# Altium schematic sheet Sensors.SchDoc: Sensors
size 279 x 203 mm; DrawnBy: FitC Engineers; Revision: 1; SheetNumber: 4; SheetTotal: 5
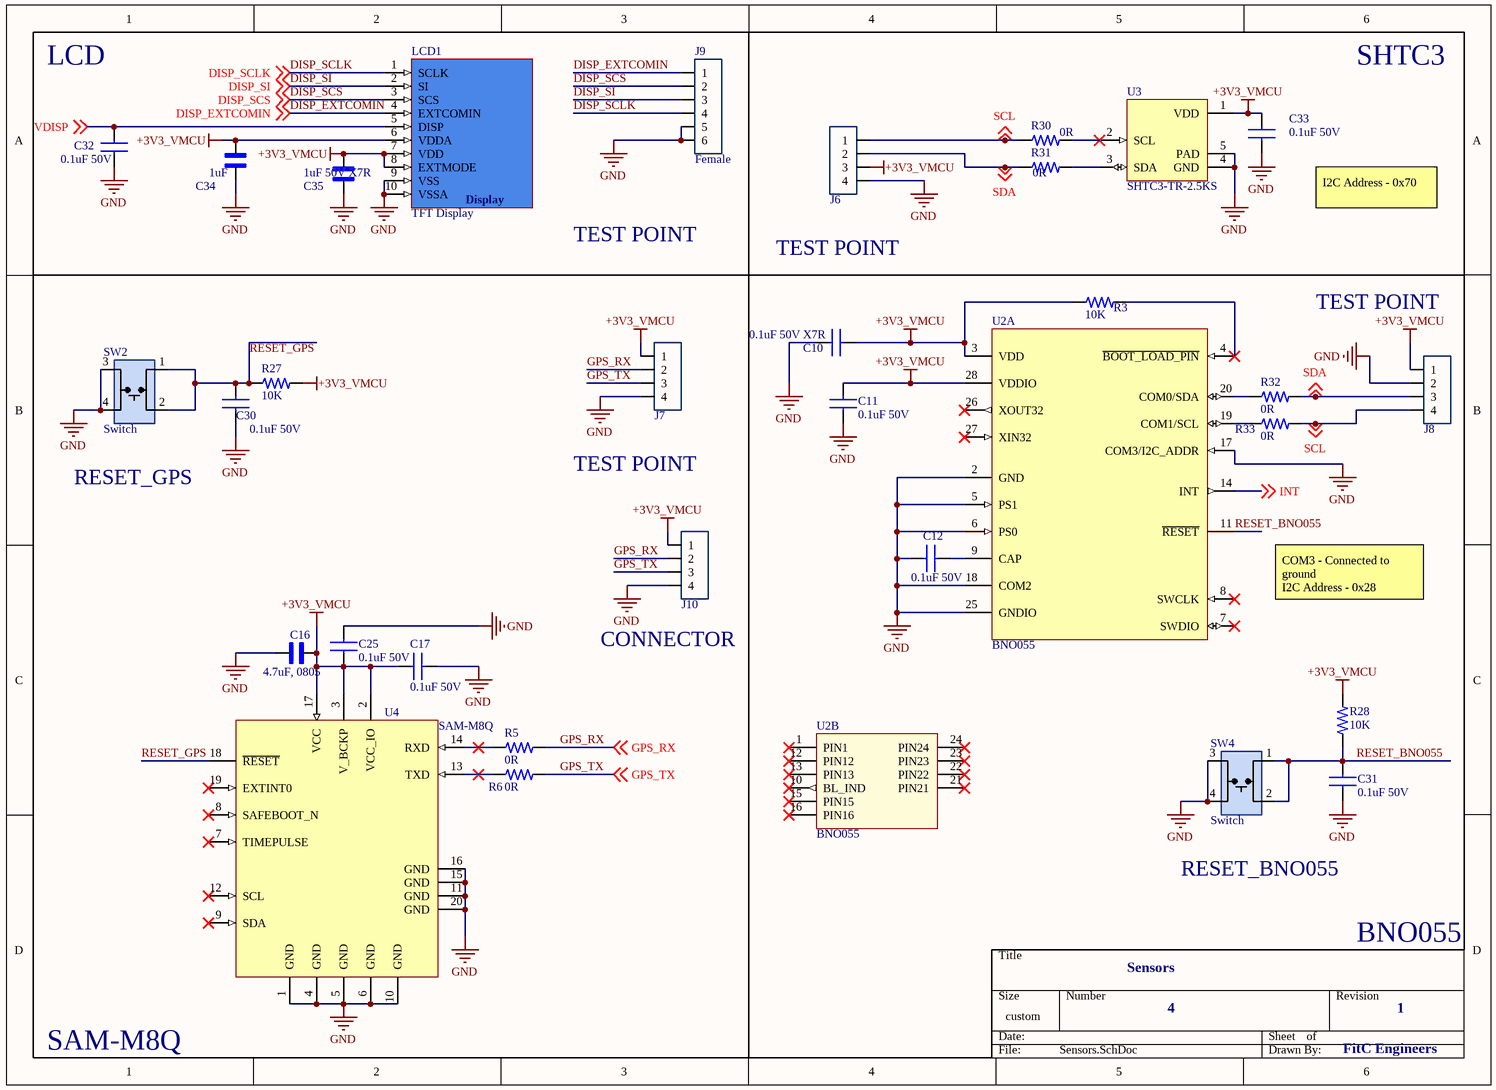
[diagram p0: Sensors.SchDoc]

## Parts
C10  0.1uF 50V X7R  [CAP_0603_1MM]
C11  0.1uF 50V  [CAP_0603_1MM]
C12  0.1uF 50V  [CAP_0603_1MM]
C16  4.7uF, 0805  [CAP_0805_2012X14]
C17  0.1uF 50V  [CAP_0603_1MM]
C25  0.1uF 50V  [CAP_0603_1MM]
C30  0.1uF 50V  [CAP_0603_1MM]
C31  0.1uF 50V  [CAP_0603_1MM]
C32  0.1uF 50V  [CAP_0603_1MM]
C33  0.1uF 50V  [CAP_0603_1MM]
C34  1uF  [CAP_0603_1MM]
C35  1uF 50V X7R  [CAP_0603_1MM]
J6  J_4_PIN_HEADER  [4_PIN_100MIL]  (value not drawn)
J7  J_4_PIN_HEADER  [4_PIN_100MIL]  (value not drawn)
J8  J_4_PIN_HEADER  [4_PIN_100MIL]  (value not drawn)
J9  value Female  [6_PIN_100MIL]  (hidden comment: PPTC061LFBN-RC)
J10  J_4_PIN_HEADER  [4_PIN_100MIL]  (value not drawn)
LCD1  TFT Display  [10Pin_LCD_Connector]
R3  10K  [RES_0603_1608X06]
R5  0R  [RES_0603_1608X06]
R6  0R  [RES_0603_1608X06]
R27  10K  [RES_0603_1608X06]
R28  10K  [RES_0603_1608X06]
R30  0R  [RES_0603_1608X06]
R31  0R  [RES_0603_1608X06]
R32  0R  [RES_0603_1608X06]
R33  0R  [RES_0603_1608X06]
SW2  Switch  [SWITCH]
SW4  Switch  [SWITCH]
U2  BNO055  [BNO055_LGA]  (parts A,B of 2)
U3  SHTC3-TR-2.5KS  [SHTC3_SON]
U4  SAM-M8Q  [SAM-M8]

## Nets
+3V3_VMCU: C10.2 C11.1 C16.1 C17.2 C25.2 C33.2 C34.1 C35.1 J6.3 J7.1 J8.1 J10.1 LCD1.6(VDDA) LCD1.7(VDD) LCD1.8(EXTMODE) R3.1 R27.2 R28.2 U2.3(VDD) U2.28(VDDIO) U3.1(VDD) U4.2(VCC_IO) U4.3(V_BCKP) U4.17(VCC)
GND: C10.1 C11.2 C12.1 C16.2 C17.1 C25.1 C30.2 C31.2 C32.2 C33.1 C34.2 C35.2 J6.4 J7.4 J8.2 J9.5 J9.6 J10.4 LCD1.9(VSS) LCD1.10(VSSA) SW2.3 SW2.4 SW4.3 SW4.4 U2.2(GND) U2.5(PS1) U2.6(PS0) U2.17(COM3/I2C_ADDR) U2.18(COM2) U2.25(GNDIO) U3.4(GND) U3.5(PAD) U4.1(GND) U4.4(GND) U4.5(GND) U4.6(GND) U4.10(GND) U4.11(GND) U4.15(GND) U4.16(GND) U4.20(GND)
DISP_EXTCOMIN: J9.1 LCD1.4(EXTCOMIN) ; off-sheet DISP_EXTCOMIN
DISP_SCLK: J9.4 LCD1.1(SCLK) ; off-sheet DISP_SCLK
DISP_SCS: J9.2 LCD1.3(SCS) ; off-sheet DISP_SCS
DISP_SI: J9.3 LCD1.2(SI) ; off-sheet DISP_SI
GPS_RX: J7.2 J10.2 R5.2 ; off-sheet GPS_RX
GPS_TX: J7.3 J10.3 R6.2 ; off-sheet GPS_TX
INT: U2.14(INT) ; off-sheet INT
RESET_BNO055: C31.1 R28.1 SW4.1 SW4.2 U2.11(~{RESET})
RESET_GPS: C30.1 R27.1 SW2.1 SW2.2 U4.18(~{RESET})
SCL: J6.1 J8.4 R30.1 R33.2 ; off-sheet SCL
SDA: J6.2 J8.3 R31.1 R32.2 ; off-sheet SDA
VDISP: C32.1 LCD1.5(DISP) ; off-sheet VDISP
NetC12_2: C12.2 U2.9(CAP)
NetR3_2: R3.2 U2.4(~{BOOT_LOAD_PIN})
NetR5_1: R5.1 U4.14(RXD)
NetR6_1: R6.1 U4.13(TXD)
NetR30_2: R30.2 U3.2(SCL)
NetR31_2: R31.2 U3.3(SDA)
NetR32_1: R32.1 U2.20(COM0/SDA)
NetR33_1: R33.1 U2.19(COM1/SCL)

Not connected (* = marked no-connect by the designer): U2 1(PIN1)* 7(SWDIO)* 8(SWCLK)* 10(BL_IND)* 12(PIN12)* 13(PIN13)* 15(PIN15)* 16(PIN16)* 21(PIN21)* 22(PIN22)* 23(PIN23)* 24(PIN24)* 26(XOUT32)* 27(XIN32)*; U4 7(TIMEPULSE)* 8(SAFEBOOT_N)* 9(SDA)* 12(SCL)* 19(EXTINT0)*

## Notes on the sheet
- LCD
- SHTC3
- I2C Address - 0x70
- TEST POINT
- RESET_GPS
- COM3 - Connected to ground
  I2C Address - 0x28
- (near J10) CONNECTOR
- RESET_BNO055
- BNO055
- SAM-M8Q
- (in symbol LS013B7DH03) Display

## Library data of the parts
C10-C12 C30-C33 = C0603X104K5RAC3121: Cap Ceramic 0.1uF 50V X7R 10% Pad SMD 0603 Flexible Termination 125C Automotive Medical Bag; Manufacturer: KEMET; Supplier 1: Digi-Key; Manufacturer Part Number: C0603X104K5RAC3121; RoHS: No; Category: Ceramic Capacitors; Stock 1: 4337; Pricing 1: 1=0.21000, 10=0.14400, 50=0.08660, 100=0.07320, 500=0.05004, 1000=0.04428 (USD); ComponentLink1URL: https://www.verical.com/server-webapp/html/getDatasheet?partID=788232&src-supplier=Verical; ComponentLink1Description: https://www.verical.com/server-webapp/html/getDatasheet?partID=788232&src-supplier=Verical; Supplier Part Number 1: 399-C0603X104K5RAC3121CT-ND
C16 = CC0805KKX5R8BB475: 0805 4.7 uF 25 V ±10% Tolerance X5R SMT Multilayer Ceramic Capacitor; Manufacturer: Yageo; Voltage Rating (DC): 25V; Supplier 1: Digi-Key; Manufacturer Part Number: CC0805KKX5R8BB475; RoHS: Yes; Category: Ceramic Capacitors; Stock 1: 260911; Pricing 1: 1=0.39000, 10=0.27000, 50=0.18940, 100=0.16230, 500=0.12172, 1000=0.10278 (USD); Mount: Surface Mount; Case/Package: 0805; Case Code (Imperial): 0805; Case Code (Metric): 2012; Weight: 0.000194oz; Min Operating Temperature: -55°C; Max Operating Temperature: 85°C; Tolerance: 10%; Packaging: Tape and Reel; Capacitance: 4.7uF; Voltage Rating: 25V; Dielectric: X5R; Termination: SMD/SMT; Resistor Type: Ceramic; Series: CC; Construction: Flat; Length: 2mm; Width: 0.049inch; Height: 1.25mm; Thickness: 0.057inch; Depth: 1.25mm; Radiation Hardening: No; Lead Free: Lead Free; Halogen Free: Halogen Free; RoHS Compliant: Yes; ComponentLink1URL: https://datasheet.ciiva.com/26946/getdatasheetpartid-788588-26946123.pdf?src-supplier=Verical; ComponentLink1Description: https://datasheet.ciiva.com/26946/getdatasheetpartid-788588-26946123.pdf?src-supplier=Verical; Supplier Part Number 1: 311-1871-1-ND
C17 C25 = C0603X104K5RAC3121_1: Cap Ceramic 0.1uF 50V X7R 10% Pad SMD 0603 Flexible Termination 125C Automotive Medical Bag; Manufacturer: KEMET; Supplier 1: Digi-Key; Manufacturer Part Number: C0603X104K5RAC3121; RoHS: No; Category: Ceramic Capacitors; Stock 1: 4337; Pricing 1: 1=0.21000, 10=0.14400, 50=0.08660, 100=0.07320, 500=0.05004, 1000=0.04428 (USD); ComponentLink1URL: https://www.verical.com/server-webapp/html/getDatasheet?partID=788232&src-supplier=Verical; ComponentLink1Description: https://www.verical.com/server-webapp/html/getDatasheet?partID=788232&src-supplier=Verical; Supplier Part Number 1: 399-C0603X104K5RAC3121CT-ND
C34 C35 = 06035C105KAT2A: 0603 1uF Multilayer Ceramic Capacitors 0603 50V X7R 105 10% TOL; Manufacturer: Kyocera AVX; Supplier 1: Digi-Key; Manufacturer Part Number: 06035C105KAT2A; RoHS: Yes; Category: Ceramic Capacitors; Stock 1: 65385; Pricing 1: 1=0.56000, 10=0.39700, 50=0.30000, 100=0.26140, 500=0.19360, 1000=0.16456 (USD); Case/Package: 0603; Capacitance: 1uF; Tolerance: 10%; Dielectric: X7R; Voltage Rating (DC): 50V; RoHS Compliant: Yes; ComponentLink1URL: http://catalogs.avx.com/SurfaceMount.pdf?src-supplier=Digi-Key; ComponentLink1Description: http://catalogs.avx.com/SurfaceMount.pdf?src-supplier=Digi-Key; ComponentLink2URL: http://datasheets.avx.com/X7RDielectric.pdf?src-supplier=Digi-Key; ComponentLink2Description: http://datasheets.avx.com/X7RDielectric.pdf?src-supplier=Digi-Key; Supplier Part Number 1: 478-10073-1-ND
J6-J8 J10 = J_4_PIN_HEADER: 4 Position Header Connector 0.100" (2.54mm) Through Hole Tin
J9 = JF_6_PIN_FEMALE: 6 Position Header Connector 0.100" (2.54mm) Through Hole Tin; Digikey Link: https://www.digikey.com/product-detail/en/PPTC061LFBN-RC/S7004-ND/810145/?itemSeq=304982353; Digikey Part: S7004-ND; LCSC Part#: DNP
LCD1 = LS013B7DH03: LCD TFT 1.28" 128X128 FPC / 1.28in LCD Monitor without Touchscreen 128x128Pixels; Manufacturer: Sharp; Touchscreen: No; Operating Supply Voltage: 3V; Interface: Serial; Diagonal Size: 1.28inch; Supplier 1: Digi-Key; Manufacturer Part Number: LS013B7DH03; RoHS: Yes; Category: LCD, OLED, Graphic Displays; Stock 1: 1435; Pricing 1: 1=12.14000, 10=8.80700, 80=7.27700, 440=6.37316, 1120=6.02553 (USD); Min Operating Temperature: -10°C; Max Operating Temperature: 60°C; Package Quantity: 560; Resolution (height): 128pixel; Resolution (width): 128pixel; Packaging: Tray; Series: -; Lead Free: Lead Free; ComponentLink1URL: https://datasheet.ciiva.com/12422/ls013b7dh0320spec-sma-224806-12422656.pdf?src-supplier=Mouser; ComponentLink1Description: https://datasheet.ciiva.com/12422/ls013b7dh0320spec-sma-224806-12422656.pdf?src-supplier=Mouser; Supplier Part Number 1: 425-2903-ND
R3 R27 R28 = RNCP0603FTD10K0: Res Thin Film 0603 10K Ohm 1% 1/8W ±100ppm/°C Molded SMD SMD Paper T/R; Manufacturer: Stackpole Electronics; Resistance: 10kR; Max Power Dissipation: 125mW; Supplier 1: Digi-Key; Manufacturer Part Number: RNCP0603FTD10K0; RoHS: Yes; Category: Chip SMD Resistors; Stock 1: 9; Pricing 1: 1=0.10000, 10=0.06100, 100=0.02480, 1000=0.01113, 2500=0.00966 (USD); Mount: Surface Mount; Case/Package: 0603; Case Code (Metric): 1608; Case Code (Imperial): 0603; Contact Plating: Tin,Matte; Min Operating Temperature: -55°C; Max Operating Temperature: 155°C; Packaging: Tape and Reel; Tolerance: 1%; Resistor Type: Thin Film; Number of Terminations: 2; Temperature Coefficient: 100ppm/°C; Features: Moisture Resistant,Anti-Sulfur; Series: RNCP; Length: 0.059inch; Width: 0.031inch; Height: 0.02inch; Radiation Hardening: No; Lead Free: Lead Free; RoHS Compliant: Yes; ComponentLink1URL: https://www.seielect.com/Catalog/SEI-rncp.pdf?src-supplier=Avnet; ComponentLink1Description: https://www.seielect.com/Catalog/SEI-rncp.pdf?src-supplier=Avnet; ComponentLink2URL: https://www.seielect.com/Catalog/SEI-rncp.pdf?src-supplier=Digi-Key; ComponentLink2Description: https://www.seielect.com/Catalog/SEI-rncp.pdf?src-supplier=Digi-Key; ComponentLink3URL: https://www.seielect.com/catalog/SEI-Packaging.pdf?src-supplier=Digi-Key; ComponentLink3Description: https://www.seielect.com/catalog/SEI-Packaging.pdf?src-supplier=Digi-Key; Supplier Part Number 1: RNCP0603FTD10K0CT-ND
R5 R6 R30-R33 = RMCF0603ZT0R00: Res Thkflm 0603 0 Ohm Jumper 1/10W 100Ppm/ C Smd Rohs Compliant: Yes; Manufacturer: Stackpole Electronics; Power Rating: 100mW; Current Rating: 1A; Working Voltage: 75V; Supplier 1: Digi-Key; Manufacturer Part Number: RMCF0603ZT0R00; RoHS: Yes; Category: Chip SMD Resistors; Pricing 1: 1=0.10000, 10=0.01300, 25=0.00960, 50=0.00720, 100=0.00530, 250=0.00404, 500=0.00324, 1000=0.00238 (USD); Mount: Surface Mount; Case/Package: 0603; Case Code (Metric): 1608; Case Code (Imperial): 0603; Contact Plating: Tin,Matte; Min Operating Temperature: -55°C; Max Operating Temperature: 155°C; Resistance: 0R; Packaging: Tape and Reel; Resistor Type: Thick Film; Number of Terminations: 2; Max Power Dissipation: 100mW; Features: Automotive AEC-Q200; Series: RMCF; Construction: Rectangular; Length: 1.55mm; Width: 0.031inch; Height: 0.022inch; Depth: 0.8mm; Radiation Hardening: No; Lead Free: Lead Free; Military Standard: Not; RoHS Compliant: Yes; ComponentLink1URL: https://www.seielect.com/catalog/SEI-Packaging.pdf?src-supplier=Digi-Key; ComponentLink1Description: https://www.seielect.com/catalog/SEI-Packaging.pdf?src-supplier=Digi-Key; ComponentLink2URL: https://www.seielect.com/Catalog/SEI-RMCF_RMCP.pdf?src-supplier=Digi-Key; ComponentLink2Description: https://www.seielect.com/Catalog/SEI-RMCF_RMCP.pdf?src-supplier=Digi-Key; ComponentLink3URL: https://www.seielect.com/catalog/SEI-Packaging.pdf?src-supplier=Arrow+Electronics; ComponentLink3Description: https://www.seielect.com/catalog/SEI-Packaging.pdf?src-supplier=Arrow+Electronics; ComponentLink4URL: https://www.seielect.com/catalog/SEI-Packaging.pdf?src-supplier=Avnet; ComponentLink4Description: https://www.seielect.com/catalog/SEI-Packaging.pdf?src-supplier=Avnet; ComponentLink5URL: https://www.seielect.com/catalog/SEI-Packaging.pdf?src-supplier=Verical; ComponentLink5Description: https://www.seielect.com/catalog/SEI-Packaging.pdf?src-supplier=Verical; Supplier Part Number 1: RMCF0603ZT0R00CT-ND
SW2 SW4 = RKB2SJM250SMTR LFS (2): Switch Tactile SPST-NO Button Gull Wing 50mA 12VDC 100000Cycle 180gf Surface Mount T/R; Manufacturer: C&K Components; Supplier 1: Digi-Key; Manufacturer Part Number: RKB2SJM250SMTR LFS; Category: Connectors; Stock 1: 5895; Pricing 1: 1=0.19000, 10=0.18600, 25=0.17640, 100=0.16050, 250=0.15088, 500=0.13804, 1000=0.11556 (USD); ComponentLink1URL: https://datasheet.octopart.com/RKB2SJM250SMTR-LFS-C%26K-Components-datasheet-151570462.pdf?src-supplier=Allied+Electronics; ComponentLink1Description: https://datasheet.octopart.com/RKB2SJM250SMTR-LFS-C%26K-Components-datasheet-151570462.pdf?src-supplier=Allied+Electronics; Supplier Part Number 1: 108-RKB2SJM250SMTRLFSCT-ND
U2 = BNO055: BNO055 Series 1.7 to 3.6 V Intelligent 9-Axis Absolute Orientation Sensor-LGA-28; Manufacturer: Bosch; Sensor Type: Accelerometer,Gyroscope,Magnetometer,3 Axis; Output Type: I2C; Supplier 1: Future Electronics; Manufacturer Part Number: BNO055; RoHS: No; Category: Inertial Measurement Units (IMUs); Pricing 1: 4000=7.71000 (USD); Mount: Surface Mount; Case/Package: LGA; Min Operating Temperature: -40°C; Max Operating Temperature: 85°C; Packaging: Tape and Reel; Lead Free: Lead Free; ComponentLink1URL: https://ae-bst.resource.bosch.com/media/_tech/media/application_notes/BST-BNO055-HS000.pdf ?src-supplier=Digi-Key; ComponentLink1Description: https://ae-bst.resource.bosch.com/media/_tech/media/application_notes/BST-BNO055-HS000.pdf ?src-supplier=Digi-Key; Supplier Part Number 1: 9049845
U3 = SHTC3-TR-2.5KS: Relative Humidity & Temperature Sensor, consumer focus; Manufacturer: Sensirion; Supplier 1: Digi-Key; Manufacturer Part Number: SHTC3-TR-2.5KS; RoHS: No; Stock 1: 9382; Pricing 1: 1=3.32000, 5=3.08800, 10=2.56500, 25=2.13760, 50=1.90000, 100=1.80500, 500=1.52000, 1000=1.42500 (USD); Supplier Part Number 1: 1649-SHTC3-TR-2.5KSCT-ND
U4 = SAM-M8Q-0-10: Rf Rx Galileo 1.575GHZ/1.602GHZ; Manufacturer: u-blox; Interface: I2C,SPI,USB,UART; Sensitivity: -165dBm; Data Rate: 400Kbps; Supplier 1: Digi-Key; Manufacturer Part Number: SAM-M8Q-0-10; RoHS: Yes; Category: RF Receivers, Transceivers; Stock 1: 14250; Pricing 1: 1=31.50000, 10=25.91000, 50=21.24000, 100=17.04010 (USD); Case/Package: SMD/SMT; Min Operating Temperature: -40°C; Max Operating Temperature: 85°C; Packaging: Tape and Reel; Frequency: 1.602GHz; ComponentLink1URL: https://www.u-blox.com/sites/default/files/SAM-M8Q_ProductSummary_%28UBX-15027452%29.pdf?src-supplier=Digi-Key; ComponentLink1Description: https://www.u-blox.com/sites/default/files/SAM-M8Q_ProductSummary_%28UBX-15027452%29.pdf?src-supplier=Digi-Key; ComponentLink2URL: https://www.u-blox.com/sites/default/files/SAM-M8Q_DataSheet_%28UBX-16012619%29.pdf?src-supplier=Digi-Key; ComponentLink2Description: https://www.u-blox.com/sites/default/files/SAM-M8Q_DataSheet_%28UBX-16012619%29.pdf?src-supplier=Digi-Key; Supplier Part Number 1: 672-1054-1-ND